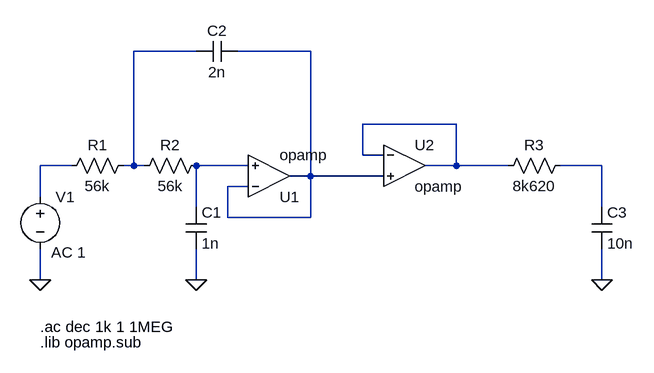
[diagram p0: schematic TS5.asc]
TS5.asc, the LTspice schematic file:
Version 4.1
SHEET 1 1144 680
WIRE 352 -208 256 -208
WIRE 528 -208 416 -208
WIRE 752 -96 608 -96
WIRE 608 -48 608 -96
WIRE 640 -48 608 -48
WIRE 160 -32 112 -32
WIRE 256 -32 256 -208
WIRE 256 -32 240 -32
WIRE 272 -32 256 -32
WIRE 432 -32 352 -32
WIRE 752 -32 752 -96
WIRE 752 -32 704 -32
WIRE 832 -32 752 -32
WIRE 976 -32 912 -32
WIRE 528 -16 528 -208
WIRE 528 -16 496 -16
WIRE 640 -16 528 -16
WIRE 432 0 400 0
WIRE 112 16 112 -32
WIRE 352 32 352 -32
WIRE 976 32 976 -32
WIRE 400 48 400 0
WIRE 528 48 528 -16
WIRE 528 48 400 48
WIRE 112 144 112 96
WIRE 352 144 352 96
WIRE 976 144 976 96
FLAG 112 144 0
FLAG 352 144 0
FLAG 976 144 0
SYMBOL OpAmps\\opamp 464 48 M180
SYMATTR InstName U1
SYMBOL voltage 112 0 R0
WINDOW 123 17 102 Left 2
WINDOW 39 0 0 Left 0
SYMATTR Value2 AC 1
SYMATTR InstName V1
SYMATTR Value ""
SYMBOL OpAmps\\opamp 672 -96 R0
SYMATTR InstName U2
SYMBOL res 256 -48 R90
WINDOW 0 0 56 VBottom 2
WINDOW 3 32 56 VTop 2
SYMATTR InstName R1
SYMATTR Value 56k
SYMBOL res 368 -48 R90
WINDOW 0 0 56 VBottom 2
WINDOW 3 32 56 VTop 2
SYMATTR InstName R2
SYMATTR Value 56k
SYMBOL cap 416 -224 R90
WINDOW 0 0 32 VBottom 2
WINDOW 3 32 32 VTop 2
SYMATTR InstName C2
SYMATTR Value 2n
SYMBOL cap 336 32 R0
SYMATTR InstName C1
SYMATTR Value 1n
SYMBOL res 928 -48 R90
WINDOW 0 0 56 VBottom 2
WINDOW 3 32 56 VTop 2
SYMATTR InstName R3
SYMATTR Value 8k620
SYMBOL cap 960 32 R0
SYMATTR InstName C3
SYMATTR Value 10n
TEXT 112 216 Left 2 !.ac dec 1k 1 1MEG
TEXT 112 240 Left 2 !.lib opamp.sub

The netlist it stands for:
* TS5.asc
X§U1 N002 N005 N002 opamp Aol=100K GBW=10Meg  ; pins invin noninvin out
V1 N004 0 AC 1
X§U2 N003 N002 N003 opamp Aol=100K GBW=10Meg  ; pins invin noninvin out
R1 N001 N004 56k
R2 N005 N001 56k
C2 N002 N001 2n
C1 N005 0 1n
R3 N006 N003 8k620
C3 N006 0 10n
.ac dec 1k 1 1MEG
.lib opamp.sub
.backanno
.end